# Altium schematic sheet MCU.SchDoc
size A2
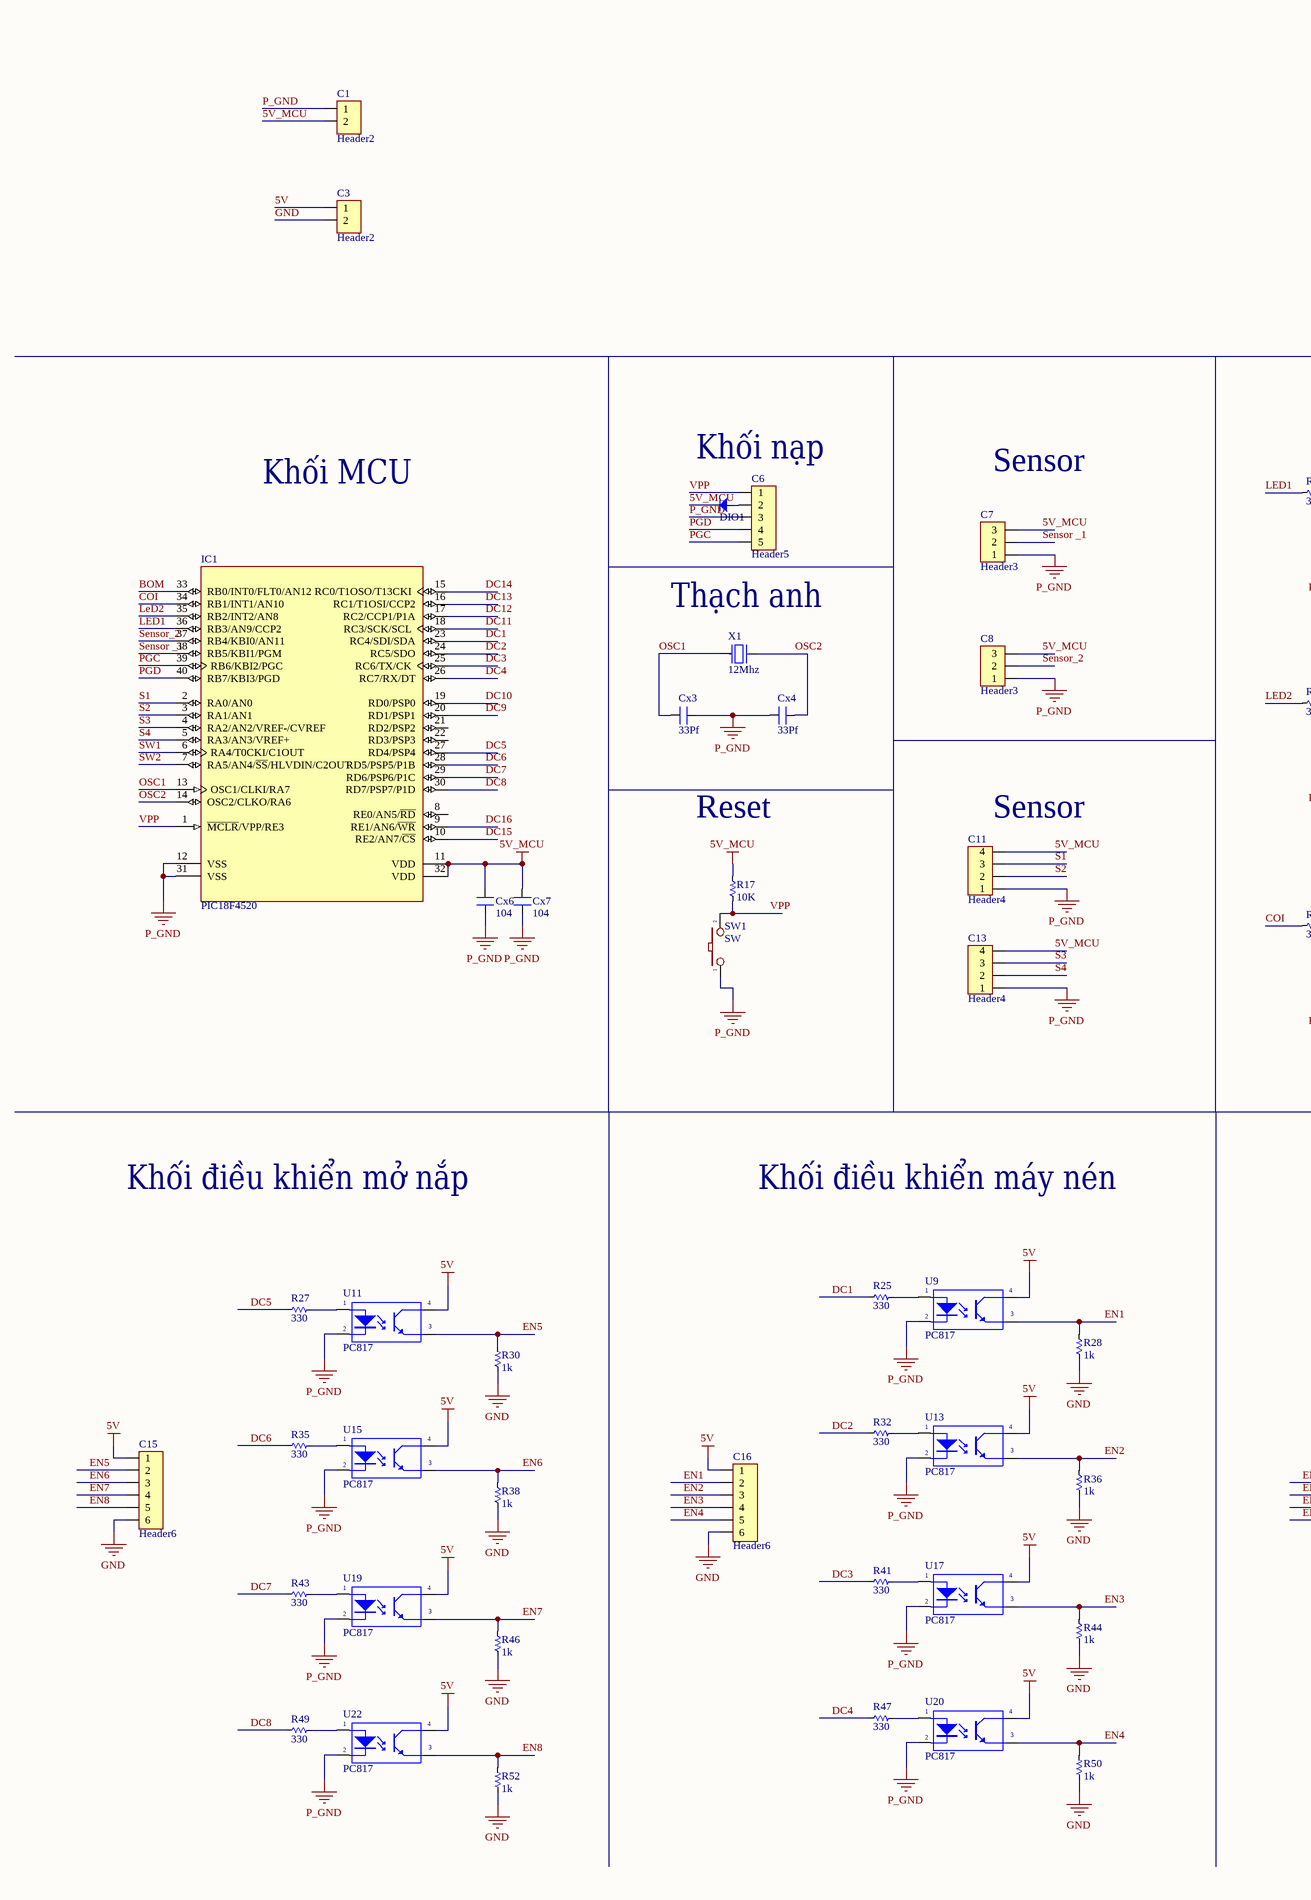
[diagram p0: MCU.SchDoc, left]
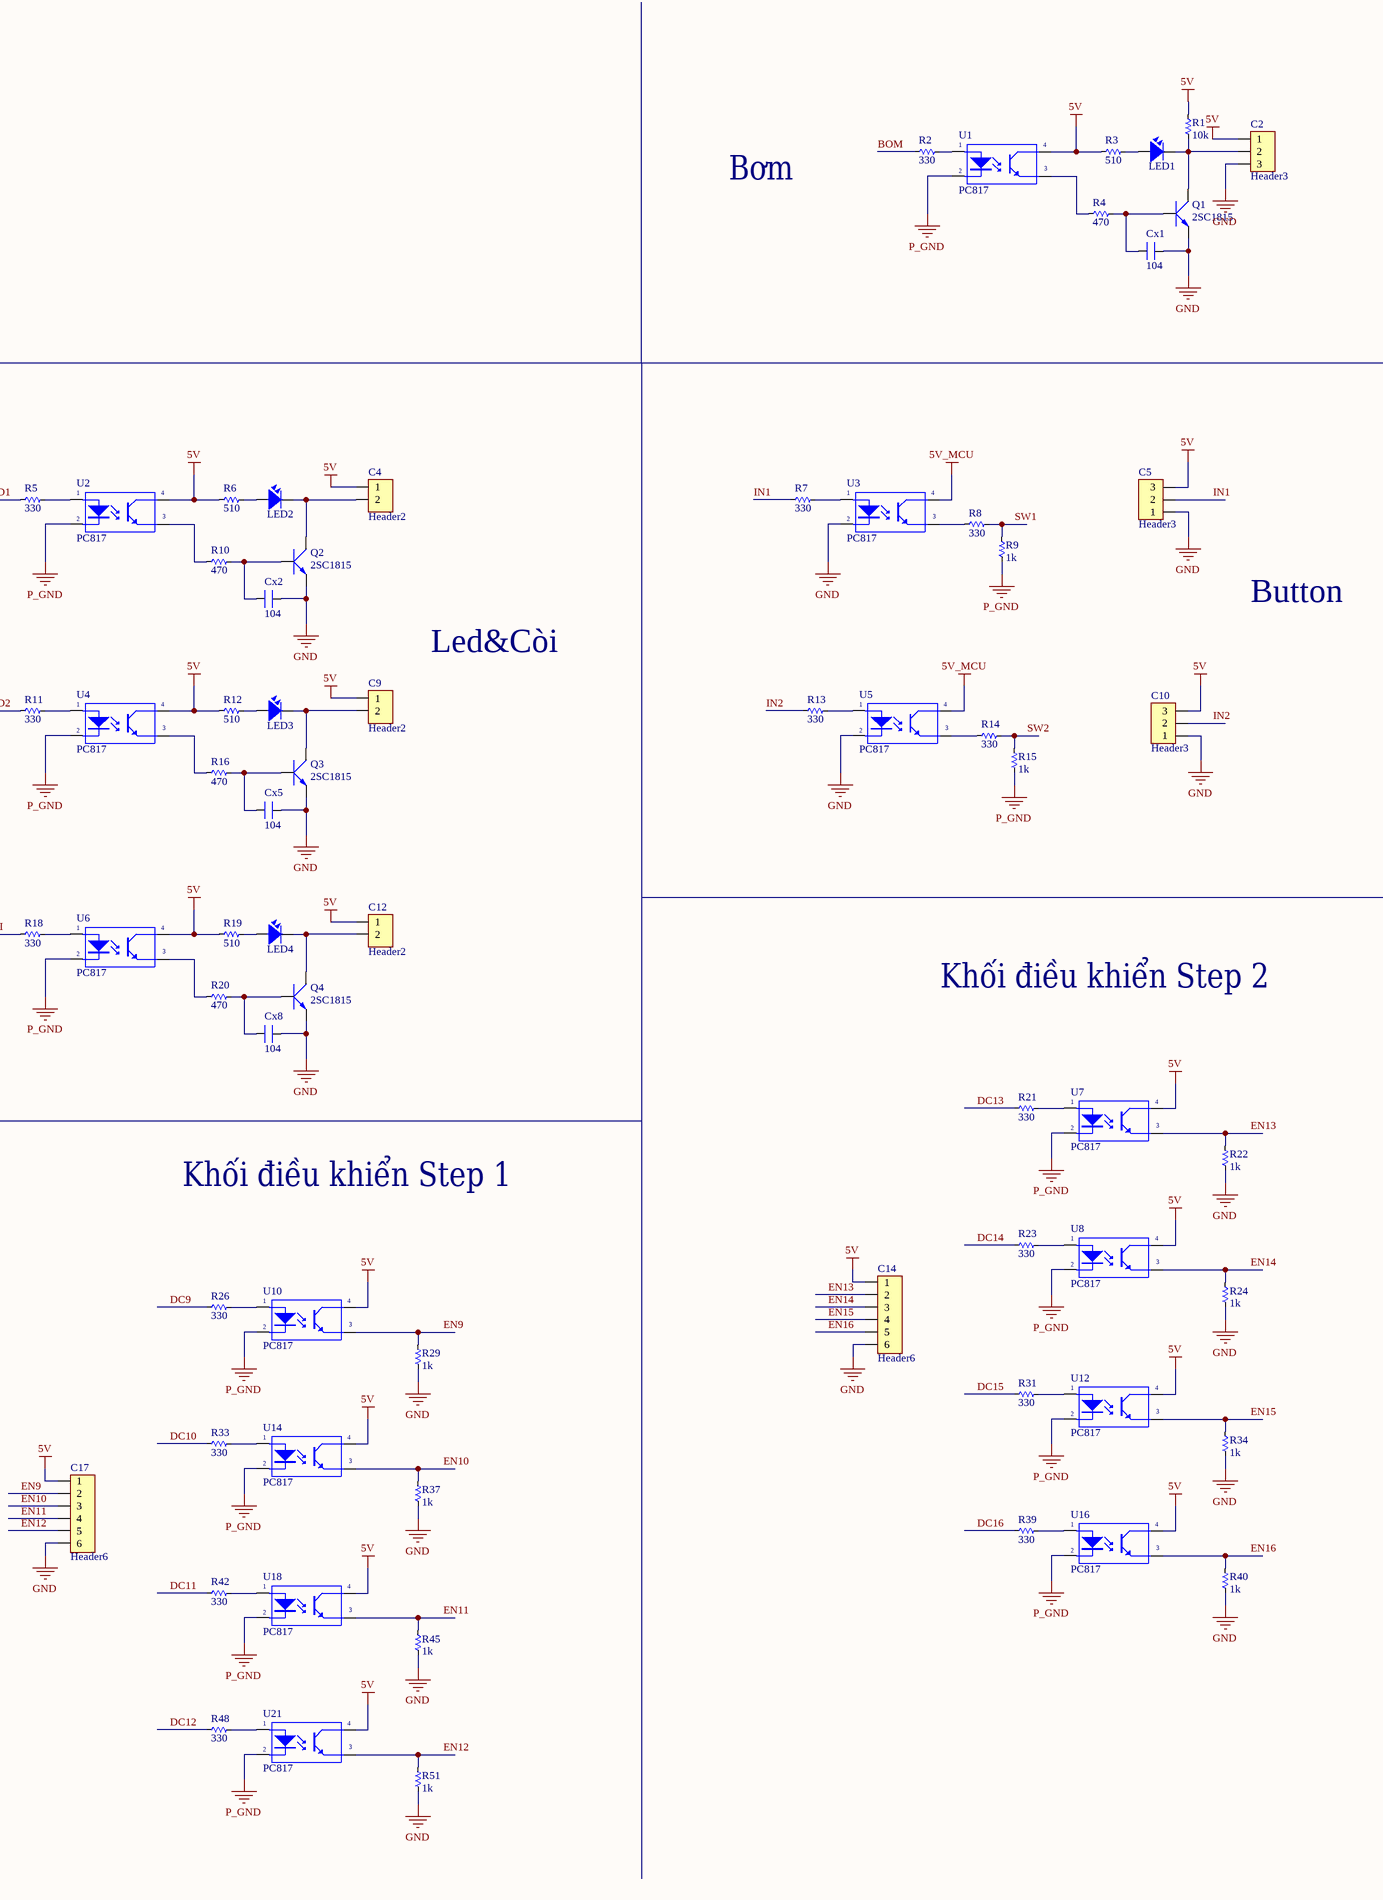
[diagram p1: MCU.SchDoc, right]

## Parts
C1  Header2  [Header2]
C2  Header3  [Header3]
C3  Header2  [Header2]
C4  Header2  [Header2]
C5  Header3  [Header3]
C6  Header5  [HDR5]
C7  Header3  [HDR3]
C8  Header3  [HDR3]
C9  Header2  [Header2]
C10  Header3  [Header3]
C11  Header4  [Header4]
C12  Header2  [Header2]
C13  Header4  [Header4]
C14  Header6  [HDR6]
C15  Header6  [HDR6]
C16  Header6  [HDR6]
C17  Header6  [HDR6]
Cx1  104  [CN-SMD-0805]
Cx2  104  [CN-SMD-0805]
Cx3  33Pf  [CN-SMD-0805]
Cx4  33Pf  [CN-SMD-0805]
Cx5  104  [CN-SMD-0805]
Cx6  104  [CN-SMD-0805]
Cx7  104  [CN-SMD-0805]
Cx8  104  [CN-SMD-0805]
DIO1  Diode SMD  [DIO-SMD-106]  (value not drawn)
IC1  PIC18F4520  [DIP40/W0.6]
LED1  LED  [LED-0805-Red]  (value not drawn)
LED2  LED  [LED-0805-Red]  (value not drawn)
LED3  LED  [LED-0805-Red]  (value not drawn)
LED4  LED  [LED-0805-Red]  (value not drawn)
Q1  2SC1815  [SOT23-321]
Q2  2SC1815  [SOT23-321]
Q3  2SC1815  [SOT23-321]
Q4  2SC1815  [SOT23-321]
R1  10k  [RES-SMD-0805]
R2  330  [RES-SMD-0805]
R3  510  [RES-SMD-0805]
R4  470  [RES-SMD-0805]
R5  330  [RES-SMD-0805]
R6  510  [RES-SMD-0805]
R7  330  [RES-SMD-0805]
R8  330  [RES-SMD-0805]
R9  1k  [RES-SMD-0805]
R10  470  [RES-SMD-0805]
R11  330  [RES-SMD-0805]
R12  510  [RES-SMD-0805]
R13  330  [RES-SMD-0805]
R14  330  [RES-SMD-0805]
R15  1k  [RES-SMD-0805]
R16  470  [RES-SMD-0805]
R17  10K  [RES-SMD-0805]
R18  330  [RES-SMD-0805]
R19  510  [RES-SMD-0805]
R20  470  [RES-SMD-0805]
R21  330  [RES-SMD-0805]
R22  1k  [RES-SMD-0805]
R23  330  [RES-SMD-0805]
R24  1k  [RES-SMD-0805]
R25  330  [RES-SMD-0805]
R26  330  [RES-SMD-0805]
R27  330  [RES-SMD-0805]
R28  1k  [RES-SMD-0805]
R29  1k  [RES-SMD-0805]
R30  1k  [RES-SMD-0805]
R31  330  [RES-SMD-0805]
R32  330  [RES-SMD-0805]
R33  330  [RES-SMD-0805]
R34  1k  [RES-SMD-0805]
R35  330  [RES-SMD-0805]
R36  1k  [RES-SMD-0805]
R37  1k  [RES-SMD-0805]
R38  1k  [RES-SMD-0805]
R39  330  [RES-SMD-0805]
R40  1k  [RES-SMD-0805]
R41  330  [RES-SMD-0805]
R42  330  [RES-SMD-0805]
R43  330  [RES-SMD-0805]
R44  1k  [RES-SMD-0805]
R45  1k  [RES-SMD-0805]
R46  1k  [RES-SMD-0805]
R47  330  [RES-SMD-0805]
R48  330  [RES-SMD-0805]
R49  330  [RES-SMD-0805]
R50  1k  [RES-SMD-0805]
R51  1k  [RES-SMD-0805]
R52  1k  [RES-SMD-0805]
SW1  SW  [SW1-SMD]
U1  PC817  [SO4]
U2  PC817  [SO4]
U3  PC817  [SO4]
U4  PC817  [SO4]
U5  PC817  [SO4]
U6  PC817  [SO4]
U7  PC817  [SO4]
U8  PC817  [SO4]
U9  PC817  [SO4]
U10  PC817  [SO4]
U11  PC817  [SO4]
U12  PC817  [SO4]
U13  PC817  [SO4]
U14  PC817  [SO4]
U15  PC817  [SO4]
U16  PC817  [SO4]
U17  PC817  [SO4]
U18  PC817  [SO4]
U19  PC817  [SO4]
U20  PC817  [SO4]
U21  PC817  [SO4]
U22  PC817  [SO4]
X1  12Mhz  [XTAL-RU49/4]

## Nets
5V: C2.1 C3.1 C4.1 C5.3 C9.1 C10.3 C12.1 C14.1 C15.1 C16.1 C17.1 R1.1 R3.2 R6.2 R12.2 R19.2 U1.4(C) U2.4(C) U4.4(C) U6.4(C) U7.4(C) U8.4(C) U9.4(C) U10.4(C) U11.4(C) U12.4(C) U13.4(C) U14.4(C) U15.4(C) U16.4(C) U17.4(C) U18.4(C) U19.4(C) U20.4(C) U21.4(C) U22.4(C)
5V_MCU: C1.2 C7.3 C8.3 C11.4 C13.4 Cx6.2 Cx7.2 DIO1.2(K) IC1.11(VDD) IC1.32(VDD) R17.1 U3.4(C) U5.4(C)
GND: C2.3 C3.2 C5.1 C10.1 C14.6 C15.6 C16.6 C17.6 Cx1.1 Cx2.1 Cx5.1 Cx8.1 Q1.1(E) Q2.1(E) Q3.1(E) Q4.1(E) R22.2 R24.2 R28.2 R29.2 R30.2 R34.2 R36.2 R37.2 R38.2 R40.2 R44.2 R45.2 R46.2 R50.2 R51.2 R52.2 U3.2(K) U5.2(K)
P_GND: C1.1 C6.3 C7.1 C8.1 C11.1 C13.1 Cx3.2 Cx4.1 Cx6.1 Cx7.1 IC1.12(VSS) IC1.31(VSS) R9.2 R15.2 SW1.1 U1.2(K) U2.2(K) U4.2(K) U6.2(K) U7.2(K) U8.2(K) U9.2(K) U10.2(K) U11.2(K) U12.2(K) U13.2(K) U14.2(K) U15.2(K) U16.2(K) U17.2(K) U18.2(K) U19.2(K) U20.2(K) U21.2(K) U22.2(K)
BOM: IC1.33(RB0/INT0/FLT0/AN12) R2.2
COI: IC1.34(RB1/INT1/AN10) R18.2
DC1: IC1.23(RC4/SDI/SDA) R25.2
DC2: IC1.24(RC5/SDO) R32.2
DC3: IC1.25(RC6/TX/CK) R41.2
DC4: IC1.26(RC7/RX/DT) R47.2
DC5: IC1.27(RD4/PSP4) R27.2
DC6: IC1.28(RD5/PSP5/P1B) R35.2
DC7: IC1.29(RD6/PSP6/P1C) R43.2
DC8: IC1.30(RD7/PSP7/P1D) R49.2
DC9: IC1.20(RD1/PSP1) R26.2
DC10: IC1.19(RD0/PSP0) R33.2
DC11: IC1.18(RC3/SCK/SCL) R42.2
DC12: IC1.17(RC2/CCP1/P1A) R48.2
DC13: IC1.16(RC1/T1OSI/CCP2) R21.2
DC14: IC1.15(RC0/T1OSO/T13CKI) R23.2
DC15: IC1.10(RE2/AN7/~{CS}) R31.2
DC16: IC1.9(RE1/AN6/~{WR}) R39.2
EN1: C16.2 R28.1 U9.3(E)
EN2: C16.3 R36.1 U13.3(E)
EN3: C16.4 R44.1 U17.3(E)
EN4: C16.5 R50.1 U20.3(E)
EN5: C15.2 R30.1 U11.3(E)
EN6: C15.3 R38.1 U15.3(E)
EN7: C15.4 R46.1 U19.3(E)
EN8: C15.5 R52.1 U22.3(E)
EN9: C17.2 R29.1 U10.3(E)
EN10: C17.3 R37.1 U14.3(E)
EN11: C17.4 R45.1 U18.3(E)
EN12: C17.5 R51.1 U21.3(E)
EN13: C14.2 R22.1 U7.3(E)
EN14: C14.3 R24.1 U8.3(E)
EN15: C14.4 R34.1 U12.3(E)
EN16: C14.5 R40.1 U16.3(E)
IN1: C5.2 R7.2
IN2: C10.2 R13.2
LED1: IC1.36(RB3/AN9/CCP2) R5.2
LED2: IC1.35(RB2/INT2/AN8) R11.2
OSC1: Cx3.1 IC1.13(OSC1/CLKI/RA7) X1.1
OSC2: Cx4.2 IC1.14(OSC2/CLKO/RA6) X1.2
PGC: C6.5 IC1.39(RB6/KBI2/PGC)
PGD: C6.4 IC1.40(RB7/KBI3/PGD)
S1: C11.3 IC1.2(RA0/AN0)
S2: C11.2 IC1.3(RA1/AN1)
S3: C13.3 IC1.4(RA2/AN2/VREF-/CVREF)
S4: C13.2 IC1.5(RA3/AN3/VREF+)
Sensor _1: C7.2 IC1.38(RB5/KBI1/PGM)
Sensor_2: C8.2 IC1.37(RB4/KBI0/AN11)
SW1: IC1.6(RA4/T0CKI/C1OUT) R8.1 R9.1
SW2: IC1.7(RA5/AN4/~{SS}/HLVDIN/C2OUT) R14.1 R15.1
VPP: C6.1 IC1.1(~{MCLR}/VPP/RE3) R17.2 SW1.2
NetC2_2: C2.2 LED1.2 Q1.2(C) R1.2
NetC4_2: C4.2 LED2.2 Q2.2(C)
NetC6_2: C6.2 DIO1.1(A)
NetC9_2: C9.2 LED3.2 Q3.2(C)
NetC12_2: C12.2 LED4.2 Q4.2(C)
NetCx1_2: Cx1.2 Q1.3(B) R4.1
NetCx2_2: Cx2.2 Q2.3(B) R10.1
NetCx5_2: Cx5.2 Q3.3(B) R16.1
NetCx8_2: Cx8.2 Q4.3(B) R20.1
NetLED1_1: LED1.1 R3.1
NetLED2_1: LED2.1 R6.1
NetLED3_1: LED3.1 R12.1
NetLED4_1: LED4.1 R19.1
NetR2_1: R2.1 U1.1(A)
NetR4_2: R4.2 U1.3(E)
NetR5_1: R5.1 U2.1(A)
NetR7_1: R7.1 U3.1(A)
NetR8_2: R8.2 U3.3(E)
NetR10_2: R10.2 U2.3(E)
NetR11_1: R11.1 U4.1(A)
NetR13_1: R13.1 U5.1(A)
NetR14_2: R14.2 U5.3(E)
NetR16_2: R16.2 U4.3(E)
NetR18_1: R18.1 U6.1(A)
NetR20_2: R20.2 U6.3(E)
NetR21_1: R21.1 U7.1(A)
NetR23_1: R23.1 U8.1(A)
NetR25_1: R25.1 U9.1(A)
NetR26_1: R26.1 U10.1(A)
NetR27_1: R27.1 U11.1(A)
NetR31_1: R31.1 U12.1(A)
NetR32_1: R32.1 U13.1(A)
NetR33_1: R33.1 U14.1(A)
NetR35_1: R35.1 U15.1(A)
NetR39_1: R39.1 U16.1(A)
NetR41_1: R41.1 U17.1(A)
NetR42_1: R42.1 U18.1(A)
NetR43_1: R43.1 U19.1(A)
NetR47_1: R47.1 U20.1(A)
NetR48_1: R48.1 U21.1(A)
NetR49_1: R49.1 U22.1(A)

Not connected (* = marked no-connect by the designer): IC1 8(RE0/AN5/~{RD}) 21(RD2/PSP2) 22(RD3/PSP3)

## Notes on the sheet
- Bơm
- Khối MCU
- Khối nạp
- Sensor
- Thạch anh
- Button
- Led&Còi
- Reset
- (near C11) Sensor
- Khối điều khiển Step 2
- Khối điều khiển Step 1
- Khối điều khiển mở nắp
- Khối điều khiển máy nén

## Library data of the parts
C1 C3 C4 C9 C12 = Header2: Header IDC, 2 x 1 Pin Vertical 2.54mm Pitch (Non-Boxed, Male); Manufacturer: W¨¹rth Elektronik eiSos GmbH; partNo: 613002143121; ComponentLink1 Description: Manufacturer; ComponentLink2 Description: Datasheet; NoPins: 02; Created Date: 29 March 2013; ComponentLink1URL: http://www.we-online.com; ComponentLink2URL: http://katalog.we-online.de/em/datasheet/6130xx143121.pdf; Created by: Karrer Zheng
C2 C5 C7 C8 C10 = Header3: Header IDC, 3 x 1 Pin Vertical 2.54mm Pitch (Non-Boxed, Male); Manufacturer: W¨¹rth Elektronik eiSos GmbH; partNo: 613002143121; ComponentLink1 Description: Manufacturer; ComponentLink2 Description: Datasheet; NoPins: 02; Created Date: 29 March 2013; ComponentLink1URL: http://www.we-online.com; ComponentLink2URL: http://katalog.we-online.de/em/datasheet/6130xx143121.pdf; Created by: Karrer Zheng
C6 = Header5: Header IDC, 5 x 1 Pin Vertical 2.54mm Pitch (Non-Boxed, Male); Manufacturer: W¨¹rth Elektronik eiSos GmbH; partNo: 613002143121; ComponentLink1 Description: Manufacturer; ComponentLink2 Description: Datasheet; NoPins: 02; Created Date: 29 March 2013; ComponentLink1URL: http://www.we-online.com; ComponentLink2URL: http://katalog.we-online.de/em/datasheet/6130xx143121.pdf; Created by: Karrer Zheng
C11 C13 = Header4: Header IDC, 4 x 1 Pin Vertical 2.54mm Pitch (Non-Boxed, Male); Manufacturer: W¨¹rth Elektronik eiSos GmbH; partNo: 613002143121; ComponentLink1 Description: Manufacturer; ComponentLink2 Description: Datasheet; NoPins: 02; Created Date: 29 March 2013; ComponentLink1URL: http://www.we-online.com; ComponentLink2URL: http://katalog.we-online.de/em/datasheet/6130xx143121.pdf; Created by: Karrer Zheng
C14-C17 = Header6: Header IDC, 6 x 1 Pin Vertical 2.54mm Pitch (Non-Boxed, Male); Manufacturer: W¨¹rth Elektronik eiSos GmbH; partNo: 613002143121; ComponentLink1 Description: Manufacturer; ComponentLink2 Description: Datasheet; NoPins: 02; Created Date: 29 March 2013; ComponentLink1URL: http://www.we-online.com; ComponentLink2URL: http://katalog.we-online.de/em/datasheet/6130xx143121.pdf; Created by: Karrer Zheng
Cx1 Cx2 Cx5-Cx8 = CN: Value: 33pF
Cx3 Cx4 = CN: Value: 33pF
DIO1 = Diode SMD: Default Diode; Code - JEDEC: DO-214-AB; Value: 1N5007; Published: 8-Jun-2000; Revision: July-2002: Re-released for DXP Platform.; Publisher: Altium Limited
IC1 = PIC18F4520: 32KB Flash, 1536B RAM, 256B EFROM, 40-Pin PDIP; Value: DIP 40; Value: 18F4520; Copyright by: VanDungEvn
LED1-LED4 = LED SMD: Value: LED 3 - 5 ly 2 Colour
Q1-Q4 = 2SC1815: NPN 600mW, ECB; Value: C1815
R1-R52 = Res-SMD: Resistor; Manufacturer: Generic Components; Class: Passive; Published: 08/06/2000; Publisher: Altium Hobart Technology Centre
SW1 = SW2: Switch button 2 pin; Value: SW chip 2 pin
U1-U22 = PC817: Single Opto; Value: PC817
X1 = XT2: Crystal, 32.768 KHz, -40 to 85 degC, 3.2 x 1.5 x 0.9 mm SMD; Value: 4Mhz